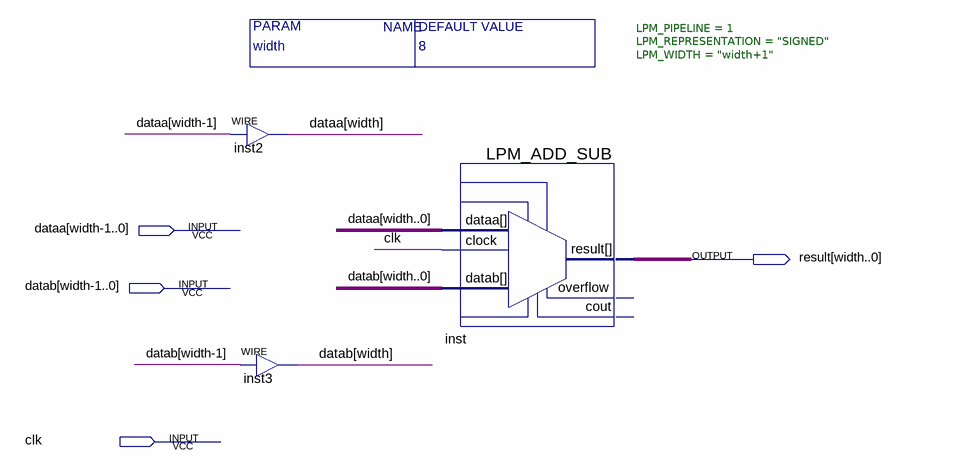
[diagram p0: schematic sheet]
// Quartus schematic add_param1.bdf as structural Verilog: 3 symbols, 4 pins
module add_param1 #(parameter width = 8) (
  input  [8:0] dataa,
  input  [8:0] datab,
  input  clk,
  output [8:0] result
);

  assign dataa[8] = dataa[7];  // WIRE inst2
  assign datab[8] = datab[7];  // WIRE inst3
  LPM_ADD_SUB #(.LPM_PIPELINE(1), .LPM_REPRESENTATION("SIGNED"), .LPM_WIDTH("width+1")) inst (
    .clock(clk), .dataa(dataa), .datab(datab), .result(result));  // open: cout, overflow
endmodule
